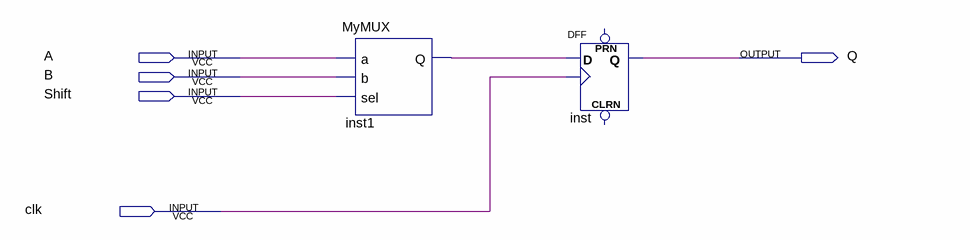
[diagram p0: schematic sheet]
// Quartus schematic MyDff.bdf as structural Verilog: 2 symbols, 5 pins
module MyDff (
  input  A,
  input  B,
  input  Shift,
  input  clk,
  output Q
);

  wire inst1_q;

  MyMUX inst1 (.a(A), .b(B), .sel(Shift), .Q(inst1_q));
  DFF inst (.CLK(clk), .D(inst1_q), .Q(Q));  // open: CLRN, PRN
endmodule
